# Altium schematic sheet RS232.SchDoc
size A; SheetNumber: 6; SheetTotal: 9
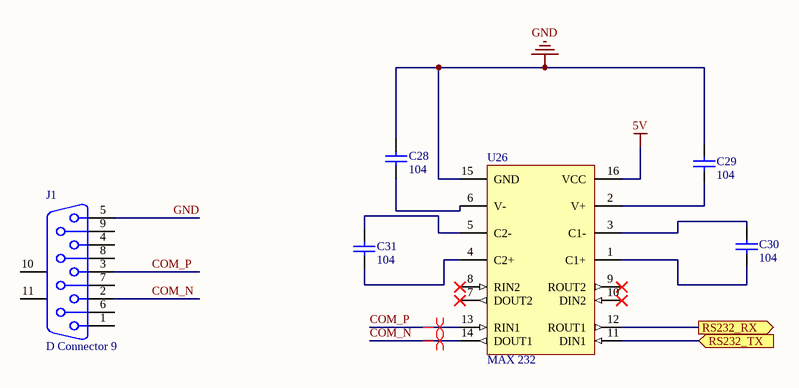
[diagram p0: RS232.SchDoc]

## Parts
C28  104  [tu 0805]
C29  104  [tu 0805]
C30  104  [tu 0805]
C31  104  [tu 0805]
J1  D Connector 9  [DSUB1.385-2H9]
U26  MAX 232  [SOIC-16]

## Ports
RS232_RX (out), RS232_TX (in)

## Nets
5V: U26.16(VCC)
GND: C28.2 C29.2 J1.5 U26.15(GND)
COM_N: J1.2 U26.14(DOUT1)
COM_P: J1.3 U26.13(RIN1)
RS232_RX: U26.12(ROUT1) ; port RS232_RX
RS232_TX: U26.11(DIN1) ; port RS232_TX
NetC28_1: C28.1 U26.6(V-)
NetC29_1: C29.1 U26.2(V+)
NetC30_1: C30.1 U26.3(C1-)
NetC30_2: C30.2 U26.1(C1+)
NetC31_1: C31.1 U26.5(C2-)
NetC31_2: C31.2 U26.4(C2+)

Not connected (* = marked no-connect by the designer): J1 1 4 6 7 8 9 10(MH1) 11(MH2); U26 7(DOUT2)* 8(RIN2)* 9(ROUT2)* 10(DIN2)*

## Layout directives
differential pair: COM_N, COM_P

## Library data of the parts
C28-C31 = Tu 0805 104 50V 10%: Dán; Don_Vi: Con; So_Chan: 2; Ten_Linh_Kien: Tụ 0805 104-100nF 10% 50V; Ma_Hang: MH004551; Chung_Loai: Dán; Kieu_Chan: *
J1 = DB9_RA: Receptacle Assembly, 9 Position, Right Angle; PackageDocument: O; Positions: 9; Published: 15-Jun-2001; LatestRevisionDate: 17-Jul-2002; LatestRevisionNote: Re-released for DXP Platform.; DatasheetDocument: 1-Sep-1999; PackageReference: 788750; Publisher: Altium Limited; Orientation: Right Angle; Gender: Receptacle
U26 = MAX3232CDRE4, MAX3232CDR: IC DRVR/RCVR MULTCH RS232 16SOIC; Solder: SMT; MPN: MAX3232CDRE4, MAX3232CDR; Value: MAX 232; Category: IC